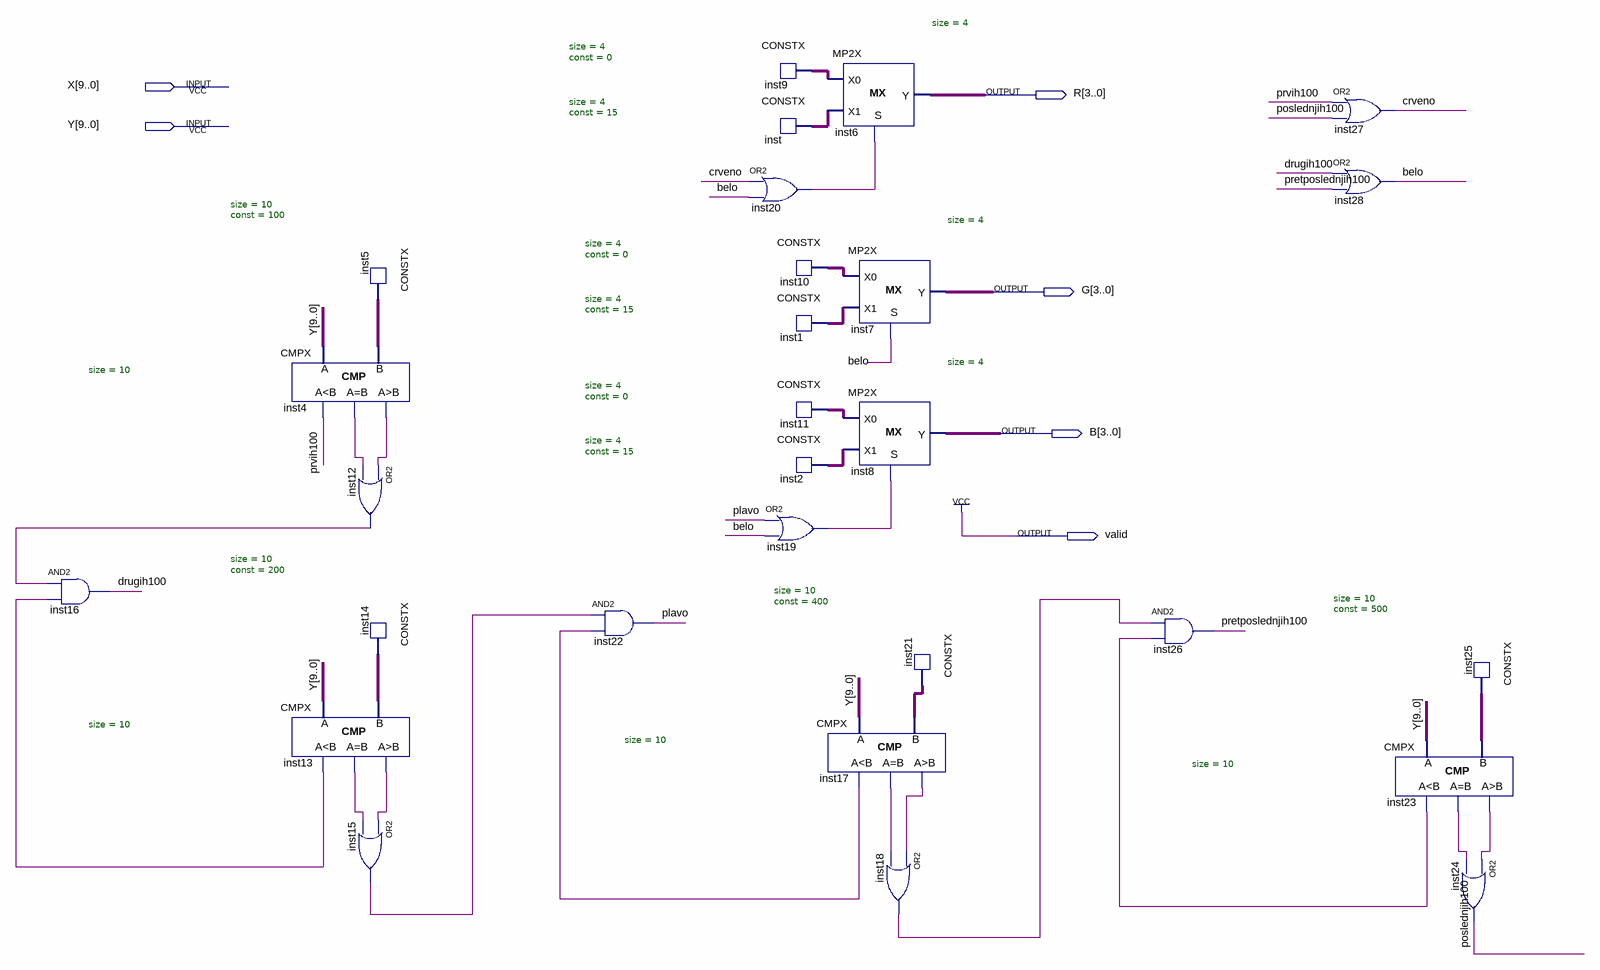
[diagram p0: schematic sheet]
// Quartus schematic Tajland.bdf as structural Verilog: 28 symbols, 6 pins
module Tajland (
  input  [9:0] X,
  input  [9:0] Y,
  output [3:0] R,
  output [3:0] G,
  output [3:0] B,
  output valid
);

  wire belo, crveno, drugih100, inst4_eq, inst4_gr, inst12_out, inst13_eq, inst13_gr, inst13_ls, inst15_out,
       inst17_eq, inst17_gr, inst17_ls, inst18_out, inst19_out, inst20_out, inst23_eq, inst23_gr, inst23_ls,
       plavo, poslednjih100, pretposlednjih100, prvih100;
  wire [3:0] inst1_data, inst2_data, inst9_data, inst10_data, inst11_data, inst_data;
  wire [9:0] inst5_data, inst14_data, inst21_data, inst25_data;

  and inst16 (drugih100, inst12_out, inst13_ls);
  CMPX #(.size(10)) inst4 (.A(Y), .B(inst5_data), .ls(prvih100), .eq(inst4_eq), .gr(inst4_gr));
  CMPX #(.size(10)) inst13 (.A(Y), .B(inst14_data), .ls(inst13_ls), .eq(inst13_eq), .gr(inst13_gr));
  CONSTX #(.size(10), .\const (100)) inst5 (.data(inst5_data));
  or inst12 (inst12_out, inst4_gr, inst4_eq);
  CONSTX #(.size(10), .\const (200)) inst14 (.data(inst14_data));
  or inst15 (inst15_out, inst13_gr, inst13_eq);
  and inst22 (plavo, inst15_out, inst17_ls);
  CONSTX #(.size(4), .\const (0)) inst9 (.data(inst9_data));
  CONSTX #(.size(4), .\const (15)) inst (.data(inst_data));
  or inst20 (inst20_out, crveno, belo);
  CONSTX #(.size(4), .\const (0)) inst10 (.data(inst10_data));
  CONSTX #(.size(4), .\const (15)) inst1 (.data(inst1_data));
  CONSTX #(.size(4), .\const (0)) inst11 (.data(inst11_data));
  CONSTX #(.size(4), .\const (15)) inst2 (.data(inst2_data));
  or inst19 (inst19_out, plavo, belo);
  MP2X #(.size(4)) inst6 (.S(inst20_out), .X0(inst9_data), .X1(inst_data), .Y(R));
  CMPX #(.size(10)) inst17 (.A(Y), .B(inst21_data), .ls(inst17_ls), .eq(inst17_eq), .gr(inst17_gr));
  MP2X #(.size(4)) inst7 (.S(belo), .X0(inst10_data), .X1(inst1_data), .Y(G));
  MP2X #(.size(4)) inst8 (.S(inst19_out), .X0(inst11_data), .X1(inst2_data), .Y(B));
  CONSTX #(.size(10), .\const (400)) inst21 (.data(inst21_data));
  or inst18 (inst18_out, inst17_gr, inst17_eq);
  and inst26 (pretposlednjih100, inst18_out, inst23_ls);
  or inst27 (crveno, prvih100, poslednjih100);
  or inst28 (belo, drugih100, pretposlednjih100);
  CMPX #(.size(10)) inst23 (.A(Y), .B(inst25_data), .ls(inst23_ls), .eq(inst23_eq), .gr(inst23_gr));
  CONSTX #(.size(10), .\const (500)) inst25 (.data(inst25_data));
  or inst24 (poslednjih100, inst23_gr, inst23_eq);

  assign valid = 1'b1;
endmodule
